# EAGLE schematic 00-eagleClass-01-battery-leds (EAGLE 7.6.0)
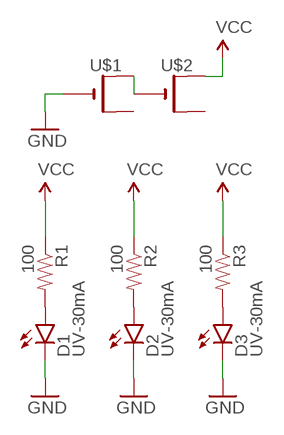
[diagram p0: schematic, sheet 1]

## Parts
D1  UV-30mA  LED5MM  [LED5MM]
D2  UV-30mA  LED5MM  [LED5MM]
D3  UV-30mA  LED5MM  [LED5MM]
R1  100  1KOHM-1/4W-5%(PTH)HORIZ-KIT  [AXIAL-0.3EZ]
R2  100  1KOHM-1/4W-5%(PTH)HORIZ-KIT  [AXIAL-0.3EZ]
R3  100  1KOHM-1/4W-5%(PTH)HORIZ-KIT  [AXIAL-0.3EZ]
U$1  CR2032THM  [CR2032-THRU]
U$2  CR2032THM  [CR2032-THRU]

## Nets
GND: D1.K(C) D2.K(C) D3.K(C) U$1.-
N$1: D1.A R1.P$2
N$4: U$1.+1(+) U$2.-
N$5: D2.A R2.P$2
N$6: D3.A R3.P$2
VCC: R1.P$1 R2.P$1 R3.P$1 U$2.+1(+)
Unconnected: U$1.+2(+1) U$2.+2(+1)

## Library data of the parts
D1-D3 = SparkFun-LED:LED: LEDs Standard schematic elements and footprints for 5mm, 3mm, 1206, and 0603 sized LEDs. 5mm - Spark Fun Electronics SKU : COM-00529 (and others); PROD_ID: VAOL-5GUV0T4-ND
R1-R3 = SparkFun-Resistors:1KOHM-1/4W-5%(PTH): RES-08380; PROD_ID: RES-08380; VALUE: 1k
U$1 U$2 = adafruit:CR2032